# Altium schematic sheet BLOCINT.SchDoc
size A4
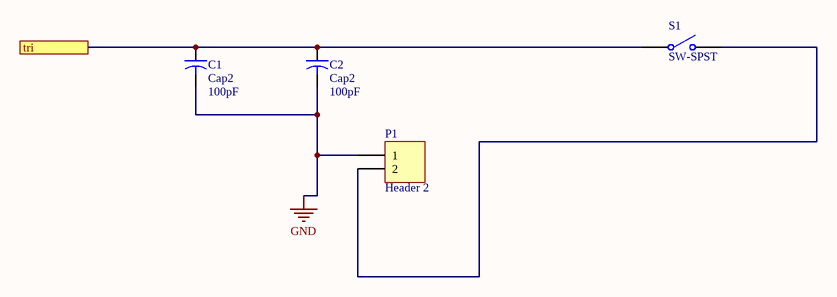
[diagram p0: BLOCINT.SchDoc]

## Parts
C1  Cap2  value 100pF  [RB7.6-15]
C2  Cap2  value 100pF  [RB7.6-15]
P1  Header 2  [HDR1X2]
S1  SW-SPST  [SPST-2]

## Ports
tri

## Nets
GND: C1.2 C2.2 P1.1
tri: C1.1 C2.1 S1.1(COMMON) ; port tri
NetP1_2: P1.2 S1.2(NO)

## Library data of the parts
C1 C2 = Cap2: Capacitor; Published: 23-Sep-2002; PackageReference: CAPR5-4X5; Publisher: Altium Limited; PackageDescription: Capacitor; 2 Leads
P1 = Header 2: Header, 2-Pin; LatestRevisionDate: 17-Jul-2002; LatestRevisionNote: Re-released for DXP Platform.; Publisher: Altium Limited
S1 = SW-SPST: Single-Pole, Single-Throw Switch; Published: 24-Mar-1999; LatestRevisionDate: 17-Jul-2002; LatestRevisionNote: Re-released for DXP Platform.; PackageReference: SPST-2; Publisher: Altium Limited; PackageDescription: Switch; 2 Leads